# Altium schematic sheet OpenMoteSTM-Border_MCU.SchDoc
size A4
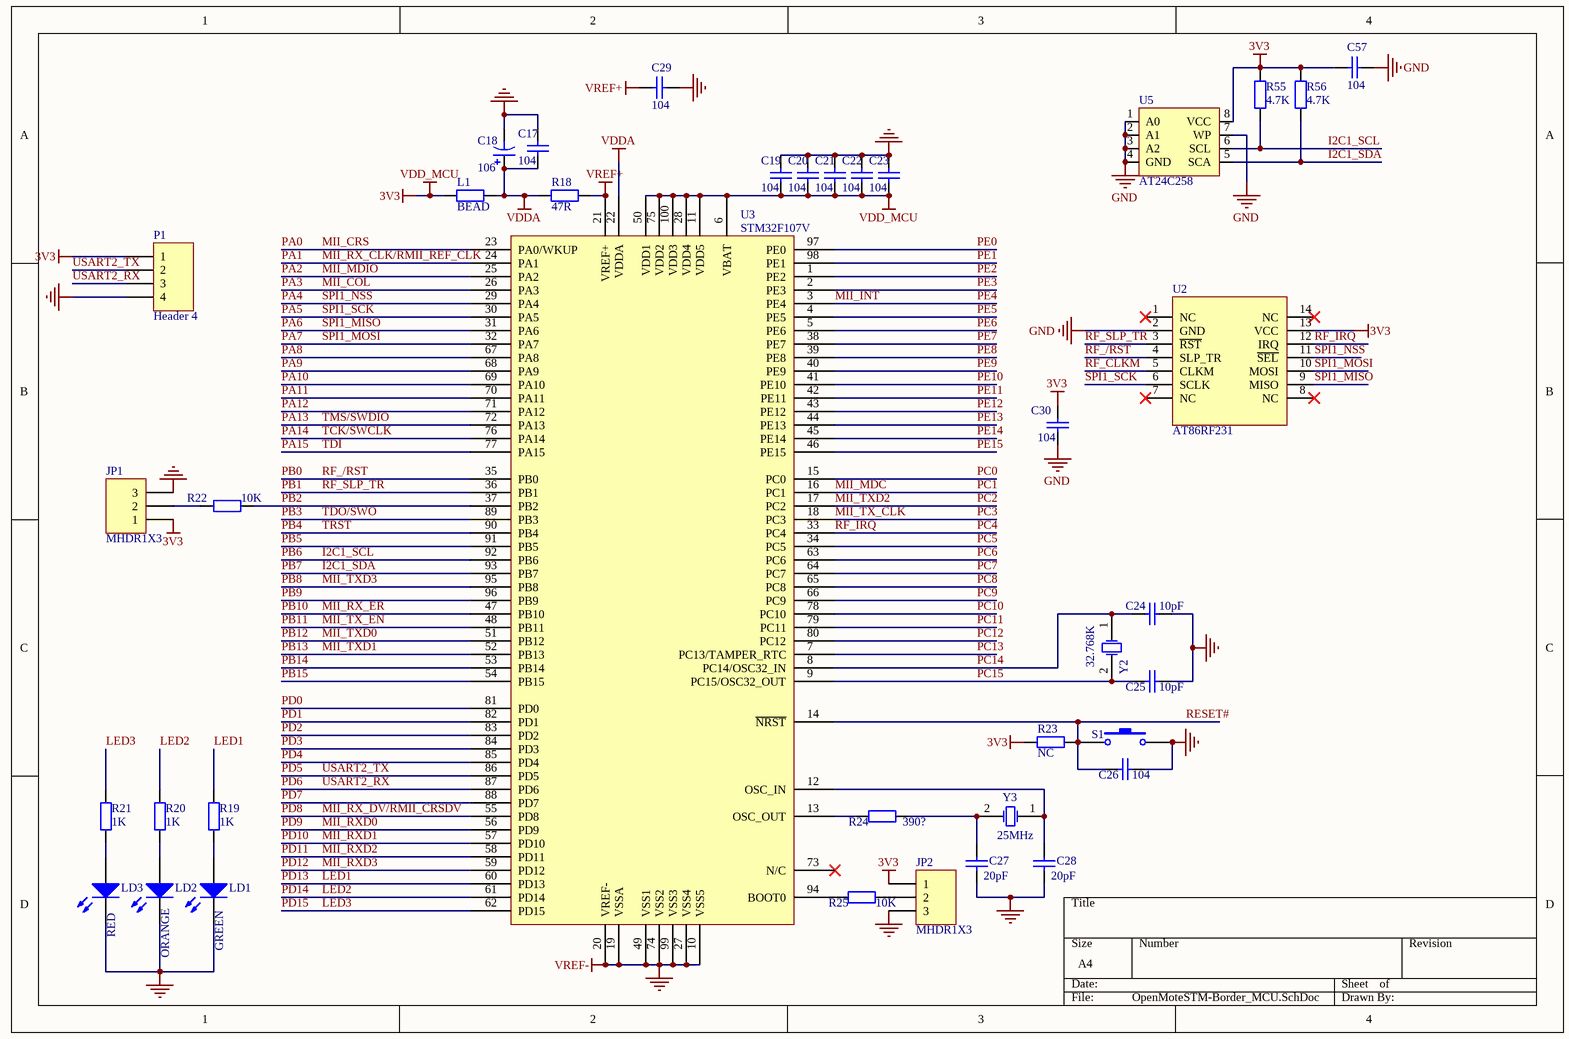
[diagram p0: OpenMoteSTM-Border_MCU.SchDoc]

## Parts
C17  value 104  [0603]  (hidden comment: Cap)
C18  value 106  [1210]  (hidden comment: Cap Pol1)
C19  value 104  [0603]  (hidden comment: Cap)
C20  value 104  [0603]  (hidden comment: Cap)
C21  value 104  [0603]  (hidden comment: Cap)
C22  value 104  [0603]  (hidden comment: Cap)
C23  value 104  [0603]  (hidden comment: Cap)
C24  value 10pF  [0603]  (hidden comment: Cap)
C25  value 10pF  [0603]  (hidden comment: Cap)
C26  value 104  [0603]  (hidden comment: Cap)
C27  value 20pF  [0603]  (hidden comment: Cap)
C28  value 20pF  [0603]  (hidden comment: Cap)
C29  value 104  [0603]  (hidden comment: Cap)
C30  value 104  [0603]  (hidden comment: Cap)
C57  value 104  [0603]  (hidden comment: Cap)
JP1  MHDR1X3  [MHDR1X3]
JP2  MHDR1X3  [MHDR1X3]
L1  value BEAD  [0603]  (hidden comment: Res2)
LD1  GREEN  [0603]
LD2  ORANGE  [0603]
LD3  RED  [0603]
P1  Header 4  [HDR1X4]
R18  value 47R  [0603]  (hidden comment: Res2)
R19  value 1K  [0603]  (hidden comment: Res2)
R20  value 1K  [0603]  (hidden comment: Res2)
R21  value 1K  [0603]  (hidden comment: Res2)
R22  value 10K  [0603]  (hidden comment: Res2)
R23  value NC  [0603]  (hidden comment: Res2)
R24  value 390?  [0603]  (hidden comment: Res2)
R25  value 10K  [0603]  (hidden comment: Res2)
R55  value 4.7K  [0603]  (hidden comment: Res2)
R56  value 4.7K  [0603]  (hidden comment: Res2)
S1  SW-PB  [KEY-SMD]  (value not drawn)
U2  AT86RF231  [AT86RF231]
U3  STM32F107V  [STM32F107]
U5  AT24C258  [AT24C256C]
Y2  32.768K  [32.768K]
Y3  25MHz  [XTAL]

## Nets
3V3: C19.1 C20.1 C21.1 C22.1 C23.1 C30.2 C57.2 JP1.1 JP2.1 L1.1 P1.1 R23.2 R55.1 R56.1 U2.13(VCC) U3.6(VBAT) U3.11(VDD5) U3.28(VDD4) U3.50(VDD1) U3.75(VDD2) U3.100(VDD3) U5.8(VCC)  [also labelled VDD_MCU]
GND: C17.2 C18.2 C19.2 C20.2 C21.2 C22.2 C23.2 C24.1 C25.2 C26.1 C27.2 C28.2 C29.2 C30.1 C57.1 JP1.3 JP2.3 LD1.2(K) LD2.2(K) LD3.2(K) P1.4 S1.2 U2.2(GND) U3.10(VSS5) U3.19(VSSA) U3.20(VREF-) U3.27(VSS4) U3.49(VSS1) U3.74(VSS2) U3.99(VSS3) U5.1(A0) U5.2(A1) U5.3(A2) U5.4(GND) U5.7(WP)  [also labelled VREF-]
VDDA: C17.1 C18.1 L1.2 R18.1 U3.22(VDDA)
VREF+: C29.1 R18.2 U3.21(VREF+)
I2C1_SCL: R55.2 U3.92(PB6) U5.6(SCL)  [also labelled PB6]
I2C1_SDA: R56.2 U3.93(PB7) U5.5(SCA)  [also labelled PB7]
LED1: R19.1 U3.60(PD13)  [also labelled PD13]
LED2: R20.1 U3.61(PD14)  [also labelled PD14]
LED3: R21.1 U3.62(PD15)  [also labelled PD15]
MII_COL: U3.26(PA3)  [also labelled PA3]
MII_CRS: U3.23(PA0/WKUP)  [also labelled PA0]
MII_INT: U3.3(PE4)  [also labelled PE4]
MII_MDC: U3.16(PC1)  [also labelled PC1]
MII_MDIO: U3.25(PA2)  [also labelled PA2]
MII_RX_CLK/RMII_REF_CLK: U3.24(PA1)  [also labelled PA1]
MII_RX_DV/RMII_CRSDV: U3.55(PD8)  [also labelled PD8]
MII_RX_ER: U3.47(PB10)  [also labelled PB10]
MII_RXD0: U3.56(PD9)  [also labelled PD9]
MII_RXD1: U3.57(PD10)  [also labelled PD10]
MII_RXD2: U3.58(PD11)  [also labelled PD11]
MII_RXD3: U3.59(PD12)  [also labelled PD12]
MII_TX_CLK: U3.18(PC3)  [also labelled PC3]
MII_TX_EN: U3.48(PB11)  [also labelled PB11]
MII_TXD0: U3.51(PB12)  [also labelled PB12]
MII_TXD1: U3.52(PB13)  [also labelled PB13]
MII_TXD2: U3.17(PC2)  [also labelled PC2]
MII_TXD3: U3.95(PB8)  [also labelled PB8]
PA4: U2.11(~{SEL}) U3.29(PA4)  [also labelled SPI1_NSS]
PA5: U2.6(SCLK) U3.30(PA5)  [also labelled SPI1_SCK]
PA6: U2.9(MISO) U3.31(PA6)  [also labelled SPI1_MISO]
PA7: U2.10(MOSI) U3.32(PA7)  [also labelled SPI1_MOSI]
PA8: U3.67(PA8)
PA9: U3.68(PA9)
PA10: U3.69(PA10)
PA11: U3.70(PA11)
PA12: U3.71(PA12)
PA13: U3.72(PA13)  [also labelled TMS/SWDIO]
PA14: U3.76(PA14)  [also labelled TCK/SWCLK]
PA15: U3.77(PA15)  [also labelled TDI]
PB0: U2.4(SLP_TR) U3.35(PB0)  [also labelled RF_/RST]
PB1: U2.3(~{RST}) U3.36(PB1)  [also labelled RF_SLP_TR]
PB2: R22.1 U3.37(PB2)
PB3: U3.89(PB3)  [also labelled TDO/SWO]
PB4: U3.90(PB4)  [also labelled TRST]
PB5: U3.91(PB5)
PB9: U3.96(PB9)
PB14: U3.53(PB14)
PB15: U3.54(PB15)
PC0: U3.15(PC0)
PC4: U2.12(IRQ) U3.33(PC4)  [also labelled RF_IRQ]
PC5: U3.34(PC5)
PC6: U3.63(PC6)
PC7: U3.64(PC7)
PC8: U3.65(PC8)
PC9: U3.66(PC9)
PC10: U3.78(PC10)
PC11: U3.79(PC11)
PC12: U3.80(PC12)
PC13: U3.7(PC13/TAMPER_RTC)
PC14: C24.2 U3.8(PC14/OSC32_IN) Y2.1(OSC1)
PC15: C25.1 U3.9(PC15/OSC32_OUT) Y2.2(OSC2)
PD0: U3.81(PD0)
PD1: U3.82(PD1)
PD2: U3.83(PD2)
PD3: U3.84(PD3)
PD4: U3.85(PD4)
PD5: P1.2 U3.86(PD5)  [also labelled USART2_TX]
PD6: P1.3 U3.87(PD6)  [also labelled USART2_RX]
PD7: U3.88(PD7)
PE0: U3.97(PE0)
PE1: U3.98(PE1)
PE2: U3.1(PE2)
PE3: U3.2(PE3)
PE5: U3.4(PE5)
PE6: U3.5(PE6)
PE7: U3.38(PE7)
PE8: U3.39(PE8)
PE9: U3.40(PE9)
PE10: U3.41(PE10)
PE11: U3.42(PE11)
PE12: U3.43(PE12)
PE13: U3.44(PE13)
PE14: U3.45(PE14)
PE15: U3.46(PE15)
RESET#: C26.2 R23.1 S1.1 U3.14(~{NRST})
RF_CLKM: U2.5(CLKM)
NetC27_1: C27.1 R24.2 Y3.2(OSC2)
NetC28_1: C28.1 U3.12(OSC_IN) Y3.1(OSC1)
NetJP1_2: JP1.2 R22.2
NetJP2_2: JP2.2 R25.1
NetLD1_1: LD1.1(A) R19.2
NetLD2_1: LD2.1(A) R20.2
NetLD3_1: LD3.1(A) R21.2
NetR24_1: R24.1 U3.13(OSC_OUT)
NetR25_2: R25.2 U3.94(BOOT0)

Not connected (* = marked no-connect by the designer): U2 1(NC)* 7(NC)* 8(NC)* 14(NC)*; U3 73(N/C)*

## Library data of the parts
C17 C19-C30 C57 = Cap: Capacitor; Published: 8-Jun-2000; LatestRevisionDate: 17-Jul-2002; LatestRevisionNote: Re-released for DXP Platform.; PackageReference: RAD-0.3; Publisher: Altium Limited
C18 = Cap Pol1: Polarized Capacitor (Radial); Published: 8-Jun-2000; LatestRevisionDate: 17-Jul-2002; LatestRevisionNote: Re-released for DXP Platform.; PackageReference: RB7.6-15; Publisher: Altium Limited
JP1 JP2 = MHDR1X3: Header, 3-Pin; LatestRevisionDate: 17-Jul-2002; LatestRevisionNote: Re-released for DXP Platform.; Publisher: Altium Limited
L1 R18-R25 R55 R56 = Res2: Resistor; Published: 8-Jun-2000; LatestRevisionDate: 17-Jul-2002; LatestRevisionNote: Re-released for DXP Platform.; PackageReference: AXIAL-0.4; Publisher: Altium Limited
LD1-LD3 = LED2: Typical RED, GREEN, YELLOW, AMBER GaAs LED; Published: 8-Jun-2000; LatestRevisionDate: 17-Jul-2002; LatestRevisionNote: Re-released for DXP Platform.; PackageDocument: Feb-2002; PackageReference: 3.2X1.6X1.1; Publisher: Altium Limited
P1 = Header 4: Header, 4-Pin; LatestRevisionDate: 17-Jul-2002; LatestRevisionNote: Re-released for DXP Platform.; Publisher: Altium Limited
S1 = SW-PB: Switch; Published: 24-Mar-1999; LatestRevisionDate: 17-Jul-2002; LatestRevisionNote: Re-released for DXP Platform.; PackageReference: SPST-2; Publisher: Altium Limited
Y2 Y3 = XTAL: Crystal Oscillator; Published: 8-Jun-2000; LatestRevisionDate: 17-Jul-2002; LatestRevisionNote: Re-released for DXP Platform.; PackageReference: R38; Publisher: Altium Limited